# Altium schematic sheet Input_Section.SchDoc
size A4; DocumentNumber: 3; SheetNumber: 3; SheetTotal: 6
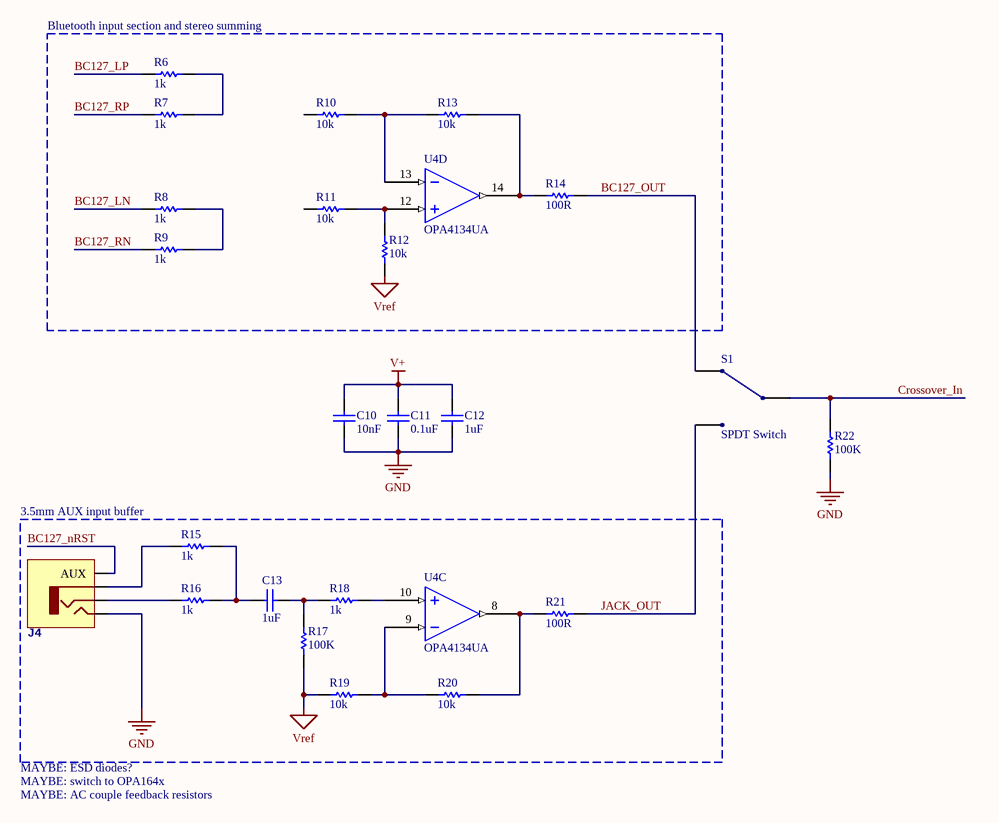
[diagram p0: Input_Section.SchDoc]

## Parts
C10  10nF  [CAPC1608X09N]
C11  0.1uF  [CAPC1608X09N]
C12  1uF  [CAPC1608X09N]
C13  1uF  [CAP Radial 5mm]
J4  3.5mm Audio Jack  [JST PH-4]  (value not drawn)
R6  1k  [RESC1608X06N]
R7  1k  [RESC1608X06N]
R8  1k  [RESC1608X06N]
R9  1k  [RESC1608X06N]
R10  10k  [RESC1608X06N]
R11  10k  [RESC1608X06N]
R12  10k  [RESC1608X06N]
R13  10k  [RESC1608X06N]
R14  100R  [RESC1608X06N]
R15  1k  [RESC1608X06N]
R16  1k  [RESC1608X06N]
R17  100K  [RESC1608X06N]
R18  1k  [RESC1608X06N]
R19  10k  [RESC1608X06N]
R20  10k  [RESC1608X06N]
R21  100R  [RESC1608X06N]
R22  100K  [RESC1608X06N]
S1  SPDT Switch  [JST PH-4]
U4  OPA4134UA  [SOIC127P600X175-14N]  (parts C,D of 4)

## Blocks framed on the sheet
Bluetooth input section and stereo summing: R6-R14 U4
3.5mm AUX input buffer: C13 J4 R15-R21 U4

## Nets
GND: C10.1 C11.1 C12.2 J4.4(LEFT) R22.1 U4.11(V-)
V+: C10.2 C11.2 C12.1
Vref: R12.1 R17.1 R19.1
BC127_LN: R8.1
BC127_LP: R6.1
BC127_nRST: J4.1(AUX)
BC127_OUT: R14.2 S1.2
BC127_RN: R9.1
BC127_RP: R7.1
Crossover_In: R22.2 S1.4
JACK_OUT: R21.2 S1.3
NetC13_1: C13.1 R15.2 R16.2
NetC13_2: C13.2 R17.2 R18.1
NetJ4_2: J4.2(SLEEVE) R15.1
NetJ4_3: J4.3(RIGHT) R16.1
NetR6_2: R6.2 R7.2
NetR8_2: R8.2 R9.2
NetR10_2: R10.2 R13.1 U4.13(-In_D)
NetR11_2: R11.2 R12.2 U4.12(+In_D)
NetR13_2: R13.2 R14.1 U4.14(Out_D)
NetR18_2: R18.2 U4.10(+In_C)
NetR19_2: R19.2 R20.1 U4.9(-In_C)
NetR20_2: R20.2 R21.1 U4.8(Out_C)

Not connected (* = marked no-connect by the designer): R10 1; R11 1; S1 1

## Notes on the sheet
- MAYBE: ESD diodes?
- MAYBE: switch to OPA164x
- MAYBE: AC couple feedback resistors

## Library data of the parts
C10 = CAP CER 10nF 0603: Bypass caps; Manufacturer: Murata; Value: 10nF; Digikey Part Number: 490-9666-1-ND
C11 = CAP CER 0.1uF 0603: Voltage: 50V; Rating: X7R; Tolerance: 10%; Value: 0.1uF; Digikey Part Number: 490-1519-1-ND; Package: 0603
C12 = CAP CER 1uF 0603: Manufacturer: Murata; Manufacturer Part Number: GRM188R7YA105KA12D; Voltage: 35V; Rating: X7R; Tolerance: 10%; Value: 1uF; Digikey Part Number: 490-10487-1-ND
C13 = CAP FILM 1uF RADIAL 5MM: Audio coupling cap; Manufacturer: EPCOS (TDK); Manufacturer P/N: B32529C105J; Voltage: 63V; Value: 1uF; Digikey Part Number: 495-1119-ND
R6-R9 R15 R16 R18 = RES 1K 0603: Manufacturer: Panasonic; Manufacturer Part Number: ERJ-PA3F1001V; Tolerance: 1%; Power: 0.25W; Type: RES; Footprint: 0603; Temperature: 155dC; Digikey Part Number: P1.0KBYCT-ND; Value: 1k
R10-R13 R19 R20 = RES 10K 0603: Manufacturer: Yageo; Manufacturer Part Number: RC0603FR-0710KL; Tolerance: 1%; Power: 0.1W; Type: RES; Footprint: 0603; Temperature: 155dC; Digikey Part Number: 311-10.0KHRCT-ND; Value: 10k
R14 R21 = RES 100R 0603: Tolerance: 1%; Power: 0.25W; Type: RES; Footprint: 0603; Digikey Part Number: 541-100SACT-ND; Value: 100R
R17 R22 = RES 100K 0603: Tolerance: 1%; Power: 0.1W; Footprint: 0603; Value: 100K; Digikey Part Number: 311-100KHRCT-ND
U4 = OPA4134UA: Quad OPAx134 Operational Amplifier; Digikey Part Number: 296-26284-1-ND; Value: OPA4134UA